# EAGLE design 6WLS-40W-OTHER (EAGLE 7.4.0)
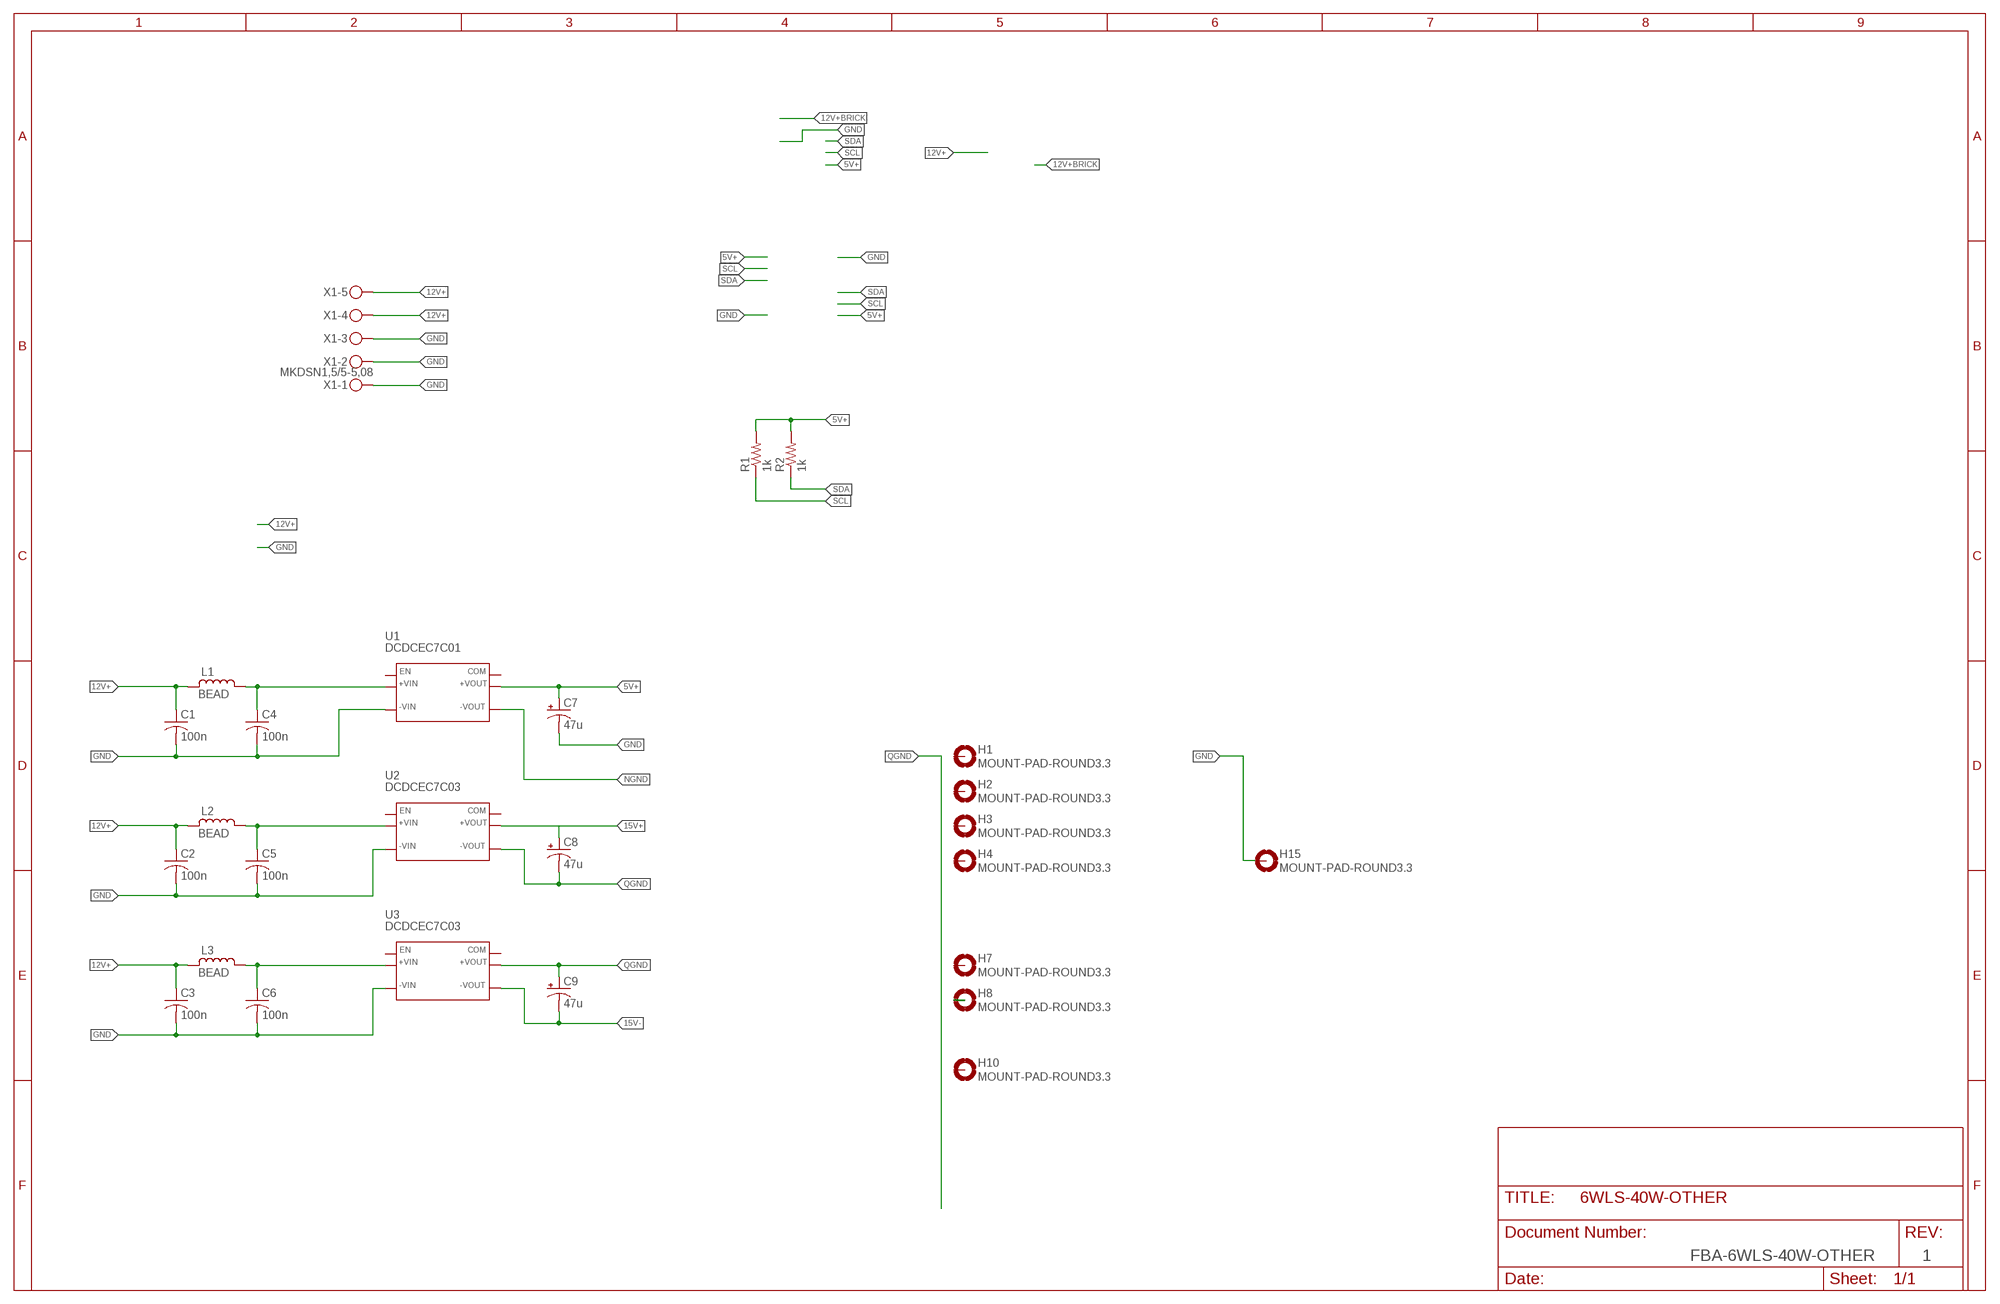
[diagram p0: schematic, sheet 1]

## Parts
C1  100n  C-US050-025X075  [C050-025X075]
C2  100n  C-US050-025X075  [C050-025X075]
C3  100n  C-US050-025X075  [C050-025X075]
C4  100n  C-US050-025X075  [C050-025X075]
C5  100n  C-US050-025X075  [C050-025X075]
C6  100n  C-US050-025X075  [C050-025X075]
C7  47u  CPOL-USE5-6  [E5-6]
C8  47u  CPOL-USE5-6  [E5-6]
C9  47u  CPOL-USE5-6  [E5-6]
H1  MOUNT-PAD-ROUND3.3  [3,3-PAD]
H2  MOUNT-PAD-ROUND3.3  [3,3-PAD]
H3  MOUNT-PAD-ROUND3.3  [3,3-PAD]
H4  MOUNT-PAD-ROUND3.3  [3,3-PAD]
H7  MOUNT-PAD-ROUND3.3  [3,3-PAD]
H8  MOUNT-PAD-ROUND3.3  [3,3-PAD]
H10  MOUNT-PAD-ROUND3.3  [3,3-PAD]
H15  MOUNT-PAD-ROUND3.3  [3,3-PAD]
L1  BEAD  L  [BEAD]
L2  BEAD  L  [BEAD]
L3  BEAD  L  [BEAD]
R1  1k  R-US_0207/7  [0207/7]
R2  1k  R-US_0207/7  [0207/7]
U1  DCDCEC7C01  [EC7C]
U2  DCDCEC7C03  [EC7C]
U3  DCDCEC7C03  [EC7C]
X1  MKDSN1,5/5-5,08  [MKDSN1,5/5-5,08]

## Nets
5V+: C7.+ R1.2 R2.2 U1.S+(+VOUT) U1.VO+(+VOUT)
12V+: C1.1 C2.1 C3.1 L1.1 L2.1 L3.1 X1.4 X1.5
15V+: C8.+ U2.S+(+VOUT) U2.VO+(+VOUT)
15V-: C9.- U3.S-(-VOUT) U3.VO-(-VOUT)
GND: C1.2 C2.2 C3.2 C4.2 C5.2 C6.2 C7.- H15.B3,3(MOUNT) U1.VIN-(-VIN) U2.VIN-(-VIN) U3.VIN-(-VIN) X1.1 X1.2 X1.3
N$1: C5.1 L2.2 U2.VIN+(+VIN)
N$2: C6.1 L3.2 U3.VIN+(+VIN)
N$3: C4.1 L1.2 U1.VIN+(+VIN)
N$5: H8.B3,3(MOUNT)
NGND: U1.S-(-VOUT) U1.VO-(-VOUT)
QGND: C8.- C9.+ U2.S-(-VOUT) U2.VO-(-VOUT) U3.S+(+VOUT) U3.VO+(+VOUT)
SCL: R1.1
SDA: R2.1
Unconnected: H1.B3,3(MOUNT) H2.B3,3(MOUNT) H3.B3,3(MOUNT) H4.B3,3(MOUNT) H7.B3,3(MOUNT) H10.B3,3(MOUNT) U1.ONOFF(EN) U2.ONOFF(EN) U3.ONOFF(EN)

## Notes on the sheet
- FBA-6WLS-40W-OTHER | 1

## Power pins joined to a net without a drawn wire
COM: U1.NC(COM) U2.NC(COM) U3.NC(COM)

## Library data of the parts
C1-C6 = resistor:C-US: CAPACITOR, American symbol
C7-C9 = resistor:CPOL-US: POLARIZED CAPACITOR, American symbol
H1-H4 H7 H8 H10 H15 = holes:MOUNT-PAD-ROUND: MOUNTING PAD, round
L1-L3 = studio_h:L: Inductor; MF: LAIRD; MPN: 28L0138-80R-10; Z_DIGIKEY: 240-2513-2-ND; Z_SMT: N
R1 R2 = resistor:R-US_: RESISTOR, American symbol
U1-U3 = studio_h:DCDC: DCDC Converter
X1 = con-phoenix-508:MKDSN1,5/5-5,08: MKDSN 1,5/ 5-5,08 Printklemme Nennstrom: 13,5 A Nennspannung: 250 V Rastermaß: 5,08 mm Polzahl: 5 Anschlussart: Schraubanschluss Montage: Löten Anschlussrichtung Leiter/Platine: 0 ° Artikelnummer: 1729157 Source: http://eshop.phoenixcontact.com .. 1729157.pdf

## Net classes
0 Signal: width 0.254 mm, clearance 0.205 mm
1 Power: width 0.508 mm, clearance 0.205 mm to class 0, clearance 0.205 mm
2 GND: width 0.889 mm

## Board
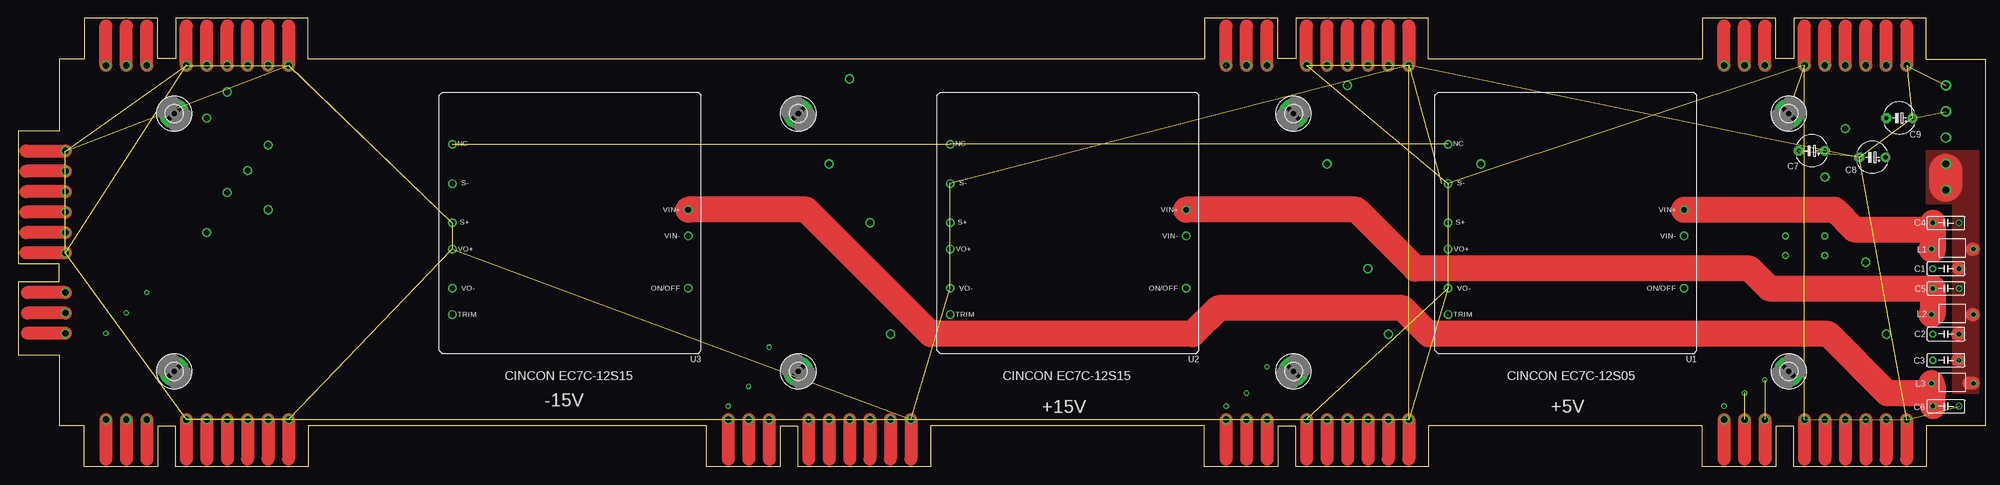
[diagram p1: board, top side]
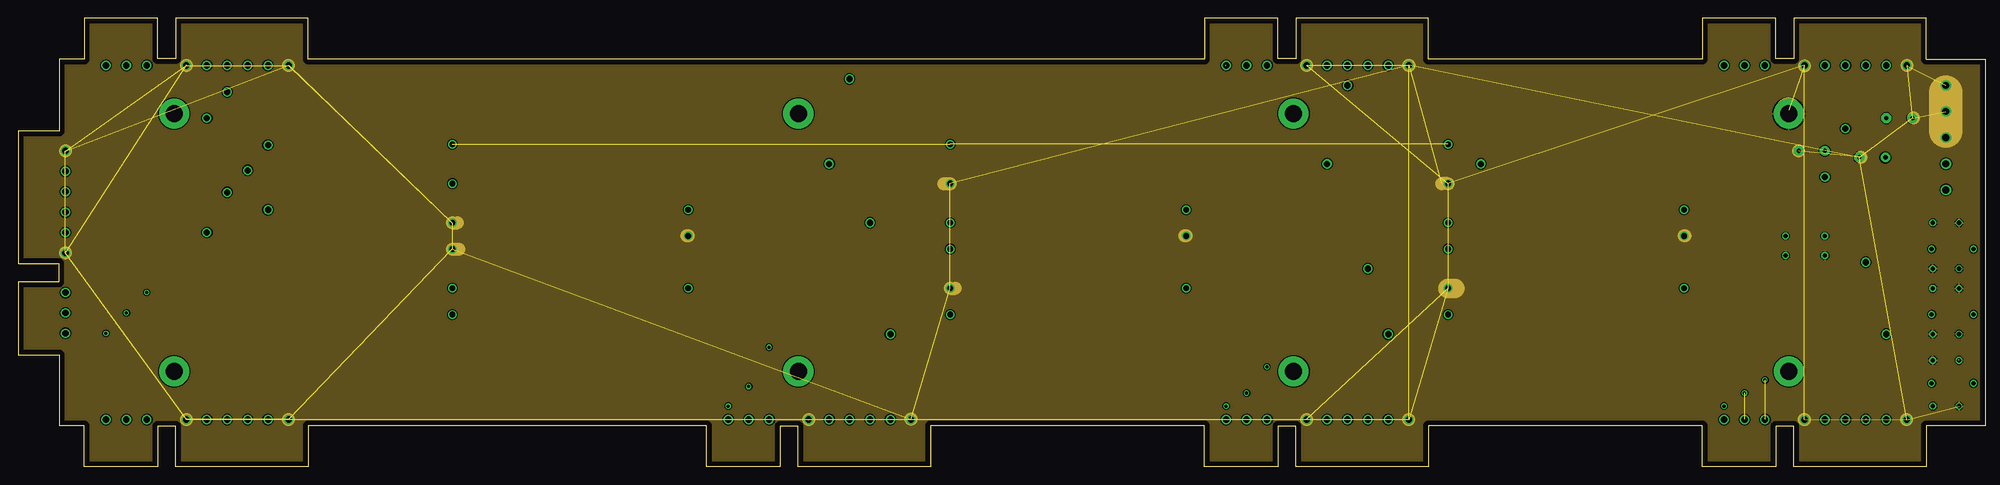
[diagram p2: board, inner layer Route2]
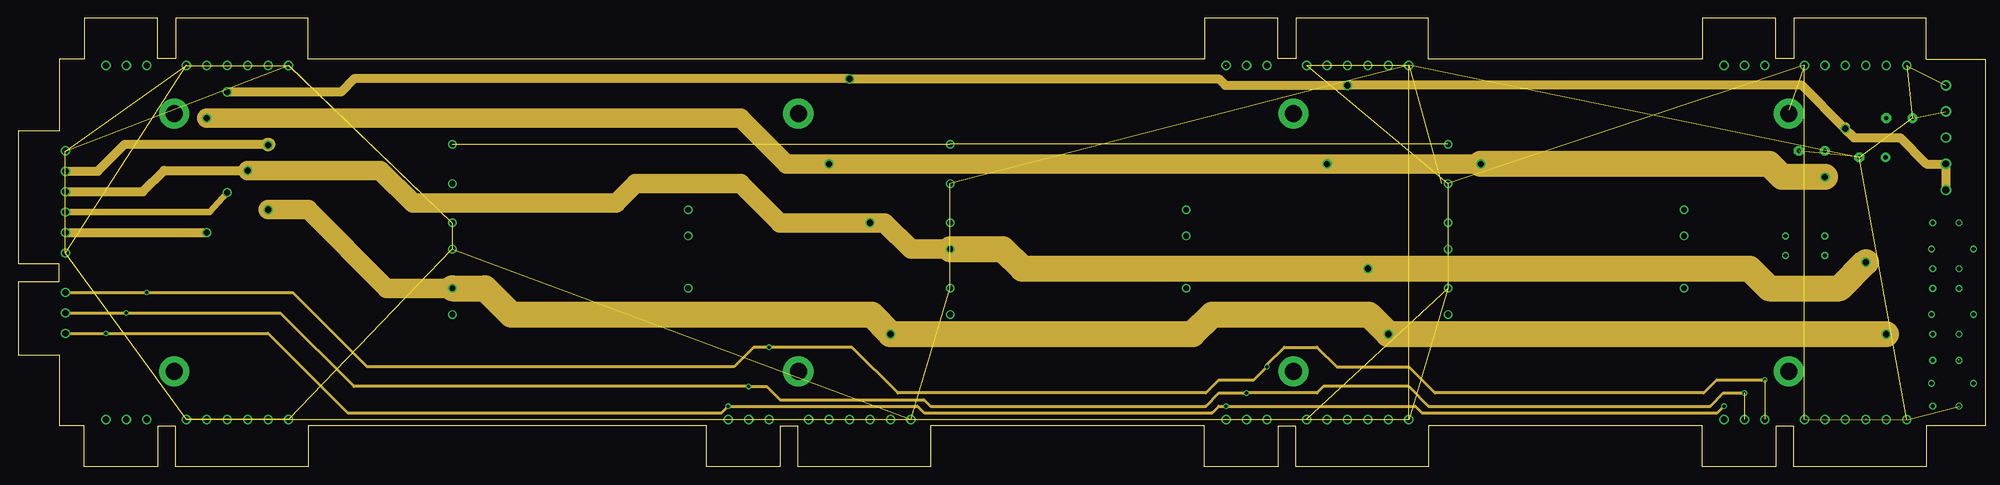
[diagram p3: board, inner layer Route15]
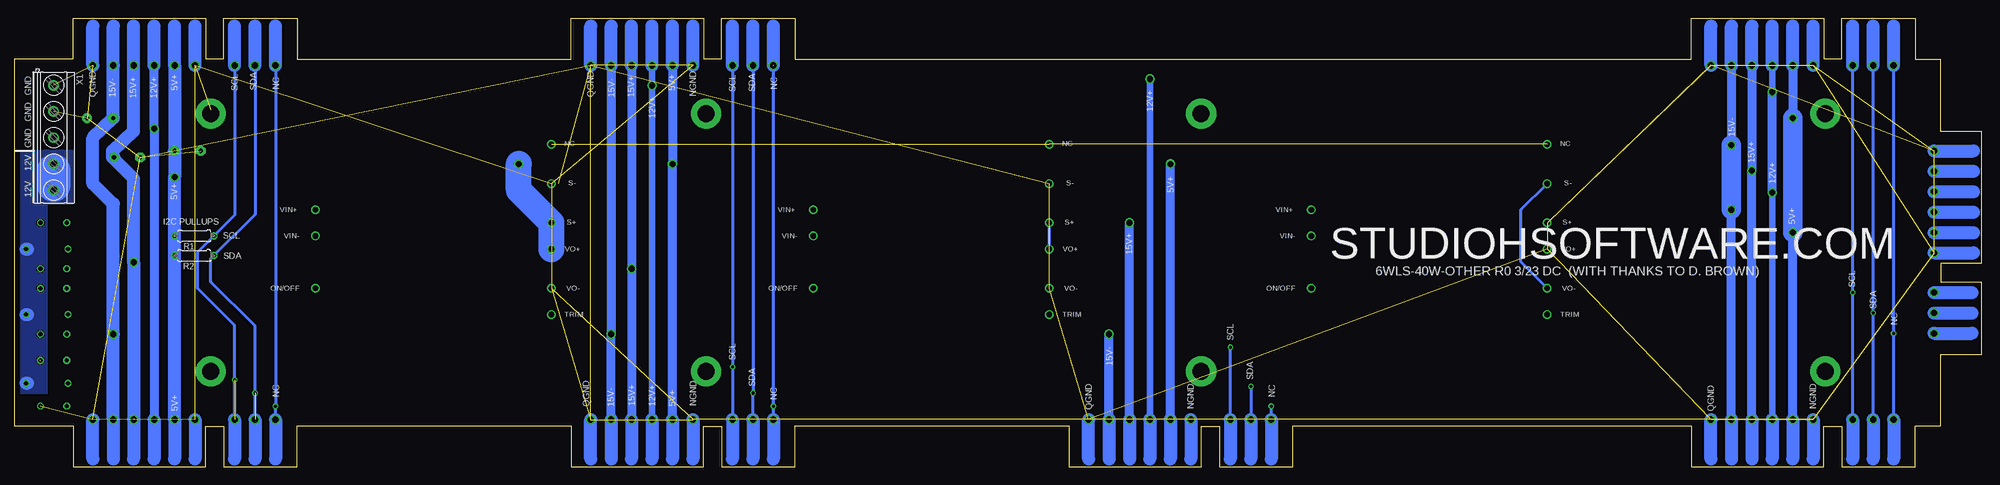
[diagram p4: board, bottom side, seen from below]

Size 381.32 x 87 mm. Coordinates in mm from the lower left corner, seen from the top.
Outline: 56.2,7.94 56.2,0 30.54,0 30.54,7.87 26.99,7.87 26.99,0 12.76,0 12.76,7.94 7.94,7.94 7.94,21.65 0,21.65 0,35.88 7.87,35.88 7.87,39.43 0,39.43 0,65.09 7.94,65.09 7.94,79.06 12.76,79.06 12.76,87 26.99,87 26.99,79.12 30.54,79.12 30.54,87 56.2,87 56.2,79.06 229.93,79.06 229.93,87 244.16,87 244.16,79.12 247.71,79.12 247.71,87 273.37,87 273.37,79.06 326.45,79.06 326.45,87 340.68,87 340.68,79.12 344.23,79.12 344.23,87 369.89,87 369.89,79.06 381.32,79.06 381.32,7.94 369.89,7.94 369.89,0 344.23,0 344.23,7.87 340.68,7.87 340.68,0 326.45,0 326.45,7.94 273.37,7.94 273.37,0 247.71,0 247.71,7.87 244.16,7.87 244.16,0 229.93,0 229.93,7.94 176.85,7.94 176.85,0 151.19,0 151.19,7.87 147.64,7.87 147.64,0 133.41,0 133.41,7.94 56.2,7.94
Copper layers (1*2*15*16): Top 0.035mm / dielectric 0.2mm / Route2 0.035mm / dielectric 1mm / Route15 0.035mm / dielectric 0.2mm / Bottom 0.035mm
Design rules "default *": minimum track width 10mil, minimum drill 20mil, track to track 8mil, track to pad 8mil, pad to pad 8mil, via to via 8mil, smd to smd 8mil, copper to edge 40mil, drill to drill 8mil, minimum pad ring 10mil, minimum via ring 8mil, stop-mask expansion 4mil, vias tented up to drill 0mil, thermal gap 10mil

### Footprints (pad centres in the part's own frame; a part is rotated, then mirrored left to right if it is on the bottom)
C050-025X075 = drill 0.813 octagon: 1 -2.54,0; 2 2.54,0
E5-6 = drill 0.813 pad 1.905: + -2.54,0 | drill 0.813 pad 1.905 octagon: - 2.54,0
3,3-PAD = drill 3.3 pad 5.842: B3,3 0,0
BEAD = drill 0.813: 1 -4.064,0; 2 4.064,0
0207/7 = drill 0.813 octagon: 1 -3.81,0; 2 3.81,0
EC7C = drill 1.1: NC 22.86,-16.51; ONOFF -22.86,11.43; S+ 22.86,-1.27; S- 22.86,-8.89; TRIM 22.86,16.51; VIN+ -22.86,-3.81; VIN- -22.86,1.27; VO+ 22.86,3.81; VO- 22.86,11.43
MKDSN1,5/5-5,08 = drill 1.3 pad 2: 1 -10.181,0.025; 2 -5.101,0.025; 3 -0.021,0.025; 4 5.059,0.025; 5 10.139,0.025

### Placement (x,y rotation side)
C1  373.7,38.42 180 top
C2  373.7,25.72 180 top
C3  373.7,20.64 180 top
C4  373.7,47.31 0 top
C5  373.7,34.61 0 top
C6  373.7,11.75 0 top
C7  347.69,61.28 180 top
C8  359.42,60.01 180 top
C9  364.66,67.63 180 top
H1  151.22,68.5 270 top
H2  151.22,18.5 270 top
H3  30.22,68.5 270 top
H4  30.22,18.5 270 top
H7  247.22,68.5 0 top
H8  247.22,18.5 0 top
H10  343.22,18.5 0 top
H15  343.22,68.5 0 top
L1  374.97,42.23 180 top
L2  374.97,29.53 180 top
L3  374.97,16.19 180 top
R1  346.42,44.77 180 bottom
R2  346.42,40.96 180 bottom
U1  300.04,46.04 180 top
U2  203.52,46.04 180 top
U3  107,46.04 180 top
X1  373.7,63.82 270 bottom

### Tracks (layer width: path | path; a pad name or v marks a point on that pad's centre or on a via)
5V+  (via drill 1.2)
  Top 2.54: v36.54,9.14 36.54,1.52 | v36.54,77.85 36.54,85.5 | v9.14,45.43 1.49,45.43 | v157.19,9.14 157.19,1.52 | v253.71,9.14 253.71,1.52 | v253.71,77.85 253.71,85.5 | v350.23,9.14 350.23,1.52 | v350.23,77.85 350.23,85.5
  Route15 1.778: v9.14,45.43 v36.54,45.43
  Route15 3.81: v36.54,67.63 140.02,67.63 148.91,58.74 v157.19,58.74 v253.71,58.74 v283.53,58.74
  Route15 5.08: v350.23,56.2 341.95,56.2 339.41,58.74 v283.53,58.74
  Bottom 1.27: 36.54,38.42 v36.54,45.43
  Bottom 1.778: v36.54,9.14 v36.54,45.43 | v36.54,77.85 v36.54,67.63 | v157.19,9.14 v157.19,58.74 | v253.71,77.85 v253.71,58.74 v253.71,9.14
  Bottom 2.54: v36.54,9.14 36.54,1.52 | v36.54,77.85 36.54,85.5 | v9.14,45.43 1.49,45.43 | v157.19,9.14 157.19,1.52 | v253.71,9.14 253.71,1.52 | v253.71,77.85 253.71,85.5 | 350.23,1.52 v350.23,9.14 R2.2 R1.2 v350.23,56.2 C7.+ v350.23,77.85 350.23,85.5
  Bottom 3.81: v36.54,67.63 v36.54,45.43
  Bottom 5.08: U1.VO+ U1.S+ 283.53,53.66 v283.53,58.74
12V+  (via drill 1.2)  (1 unrouted)
  Top 2.54: v40.5,9.14 40.5,1.52 | v40.5,77.85 40.5,85.5 | v9.14,49.39 1.49,49.39 | v257.67,9.14 257.67,1.52 | v257.67,77.85 257.67,85.5 | v354.19,9.14 354.19,1.52 | v354.19,77.85 354.19,85.5 | v161.15,9.14 161.15,1.52 | L3.1 378.14,16.19 | L2.1 378.78,29.53 | 375.91,20.69 376.19,20.69 | L1.1 378.78,42.23 | C2.1 375.96,25.72 376.24,25.69 376.19,25.77 C2.1 | C1.1 376.11,38.42 376.03,38.49 376.16,38.49 C1.1
  Top 6.452: 373.7,57.47 373.7,54.67
  Route15 1.27: v9.14,49.39 37.15,49.39 v40.5,53.2
  Route15 1.778: v40.5,72.71 62.55,72.71 65.09,75.25 v161.15,75.25 232.73,75.25 234,73.98 v257.67,73.98 345.76,73.98 354.01,65.72 | 354.01,65.72 355.92,63.82 364.81,63.82 369.89,58.74 373.65,58.74 X1.4 | v354.19,65.6 354.19,65.9 354.01,65.72 | 373.7,58.74 373.7,53.7 X1.5
  Bottom 1.27: v40.5,9.14 v40.5,53.2 | v40.5,77.85 v40.5,72.71 | v257.67,9.14 v257.67,73.98 v257.67,77.85 | v161.15,9.14 v161.15,75.25
  Bottom 1.778: v40.5,53.2 v40.5,72.71 | v354.19,9.14 v354.19,65.6 v354.19,77.85
  Bottom 2.54: v40.5,9.14 40.5,1.52 | v40.5,77.85 40.5,85.5 | v9.14,49.39 1.49,49.39 | v257.67,9.14 257.67,1.52 | v257.67,77.85 257.67,85.5 | v354.19,9.14 354.19,1.52 | v354.19,77.85 354.19,85.5 | v161.15,9.14 161.15,1.52 | L1.1 378.78,42.23 | L2.1 378.78,29.53 | L3.1 378.78,16.19
  Bottom 6.452: 373.7,57.47 373.7,54.67
  pour Top: 369.89,61.28 369.89,51.12 374.97,51.12 374.97,14.29 380.05,14.29 380.05,61.28
  pour Bottom: 369.89,61.28 380.05,61.28 380.05,14.29 374.97,14.29 374.97,51.12 369.89,51.12
15V+  (via drill 1.2)  (1 unrouted)
  Top 2.54: v44.46,9.14 44.46,1.52 | v44.46,77.85 44.46,85.5 | v9.14,53.35 1.49,53.35 | v165.11,9.14 165.11,1.52 | v261.63,9.14 261.63,1.52 | v261.63,77.85 261.63,85.5 | v358.15,9.14 358.15,1.52 | v358.15,77.85 358.15,85.5
  Route15 1.778: v9.14,53.35 24.14,53.35 28.26,57.47 v44.46,57.47
  Route15 3.81: 181.93,42.23 173.04,42.23 167.96,47.31 v165.11,47.31 147.64,47.31 140.02,54.93 119.7,54.93 115.89,51.12 76.52,51.12 70.17,57.47 v44.46,57.47
  Route15 5.08: v358.15,39.69 353.07,34.61 339.41,34.61 335.6,38.42 v261.63,38.42 194.63,38.42 190.82,42.23 181.93,42.23 U2.VO+
  Bottom 0.61: U2.VO+ U2.S+
  Bottom 1.778: v44.46,9.14 v44.46,57.47 v44.46,77.85 | v165.11,9.14 v165.11,47.31 | v261.63,9.14 v261.63,38.42 v261.63,77.85
  Bottom 2.54: v44.46,9.14 44.46,1.52 | v44.46,77.85 44.46,85.5 | v9.14,53.35 1.49,53.35 | v165.11,9.14 165.11,1.52 | v261.63,9.14 261.63,1.52 | v261.63,77.85 261.63,85.5 | v358.15,9.14 358.15,1.52 | 358.15,85.5 v358.15,77.85 358.15,65.09 362.27,61.28 362.27,60.01 | 362.27,60.01 358.15,55.89 v358.15,39.69 358.15,9.27 | C8.+ 362.27,60.01
15V-  (via drill 1.2)
  Top 2.54: v48.43,9.14 48.43,1.52 | v48.43,77.85 48.43,85.5 | v9.14,57.32 1.49,57.32 | v169.08,9.14 169.08,1.52 | v265.6,9.14 265.6,1.52 | v265.6,77.85 265.6,85.5 | v362.12,9.14 362.12,1.52 | v362.12,77.85 362.12,85.5
  Route15 0.61: 169.23,25.72 v169.08,25.72
  Route15 1.778: v9.14,57.32 15.41,57.32 20.64,62.55 48.27,62.55
  Route15 2.54: 48.58,62.55 v48.43,62.4 48.27,62.55
  Route15 3.81: v48.43,49.85 56.2,49.85 71.44,34.61 U3.VO-
  Route15 5.08: v169.08,25.72 165.42,29.53 95.57,29.53 90.49,34.61 U3.VO- | 169.23,25.72 227.65,25.72 231.46,29.53 261.79,29.53 v265.6,25.72 v362.12,25.72
  Bottom 0.61: U3.VO- 89.22,39.69 89.22,49.85 U3.S-
  Bottom 1.778: v48.43,9.14 v48.43,49.85 | v48.43,77.85 v48.43,62.4 | v169.08,9.14 v169.08,25.72 | v265.6,9.14 v265.6,25.72 v265.6,77.85
  Bottom 2.54: v48.43,9.14 48.43,1.52 | v48.43,77.85 48.43,85.5 | v9.14,57.32 1.49,57.32 | v169.08,9.14 169.08,1.52 | v265.6,9.14 265.6,1.52 | v265.6,77.85 265.6,85.5 | 362.12,1.52 v362.12,9.14 v362.12,25.72 362.12,50.97 366.08,54.93 366.08,63.82 C9.- v362.12,77.85 362.12,85.5
  Bottom 3.81: v48.43,49.85 v48.43,62.4
COM  (2 unrouted)
GND  (20 unrouted)
  Top 5.08: H15.B3,3 343.22,68.9
  Route2 2.54: 277.18,54.93 275.91,54.93 | U2.VIN- 226.12,44.77 | 84.14,42.23 85.41,42.23 | 173.04,9.21 173.06,9.21 | 153.2,9.11 153.23,9.11 | 32.55,9.18 32.58,9.18 | 52.36,9.16 52.39,9.16 | 9.13,41.49 9.16,41.49 | 9.13,61.25 9.16,61.25 | 32.58,77.84 32.6,77.84 | 52.39,77.84 52.41,77.84 | 249.75,77.86 249.77,77.86 | 269.56,77.86 269.58,77.86 | 249.72,9.13 249.75,9.13 | 269.53,9.13 269.56,9.13 | 346.21,9.16 346.24,9.16 | 366.05,9.13 366.08,9.13 | 346.27,77.79 346.29,77.79 | 366.1,77.81 366.13,77.81 | 179.39,54.93 180.66,54.93 | U3.VIN- 129.6,44.77 | 84.14,47.31 85.15,47.31 | 180.66,34.61 181.67,34.61 | 323.15,44.77 U1.VIN- | 367.37,67.65 367.4,67.65 | 357.21,60.03 357.24,60.03 | 345.12,61.28 C7.-
  Route2 3.81: 278.45,34.61 277.18,34.61
  Route2 5.08: H15.B3,3 343.22,69.15
  Route2 6.452: 373.7,65.09 373.7,72.71
  Bottom 5.08: 343.22,68.9 H15.B3,3
  pour Route2: 7.94,79.06 7.94,65.09 0.32,65.09 0.32,21.91 7.94,21.91 7.94,7.94 13.02,7.94 13.02,0.32 56.2,0.32 56.2,7.94 133.67,7.94 133.67,0.32 176.85,0.32 176.85,7.94 230.19,7.94 230.19,0.32 273.37,0.32 273.37,7.94 326.71,7.94 326.71,0.32 369.89,0.32 369.89,7.94 381.32,7.94 381.32,79.06 369.89,79.06 369.89,86.68 326.71,86.68 326.71,79.06 273.37,79.06 273.37,86.68 230.19,86.68 230.19,79.06 56.2,79.06 56.2,86.68 13.02,86.68 13.02,79.06
N$1
  Top 5.08: L2.2 371.16,29.78 C5.1 339.41,34.61 335.6,38.42 270.83,38.42 259.4,49.85 U2.VIN+
N$2
  Top 5.08: C6.1 371.16,14.29 | 371.16,14.29 371.16,15.18 L3.2 | U3.VIN+ 152.72,49.85 176.85,25.72 227.65,25.72 232.73,30.8 268.29,30.8 273.37,25.72 350.84,25.72 362.27,14.29 371.16,14.29
N$3
  Top 5.08: C4.1 371.16,46.04 | 371.16,46.04 371.16,42.23 L1.2 | U1.VIN+ 352.11,49.85 355.92,46.04 371.16,46.04
NC  (via drill 0.6, 1.2)  (1 unrouted)
  Top 2.54: v16.98,9.14 16.98,1.52 | v16.98,77.85 16.98,85.5 | v9.14,25.87 1.75,25.87 | v137.63,9.14 137.63,1.52 | v234.15,9.14 234.15,1.52 | v234.15,77.85 234.15,85.5 | v330.67,9.14 330.67,1.52 | v330.67,77.85 330.67,85.5
  Route15 0.61: v9.14,25.87 v16.98,25.87 48.43,25.87 63.82,10.48 136.36,10.48 v137.63,11.75 174.31,11.75 175.58,10.48 231.46,10.48 232.73,11.75 v234.15,11.75 270.83,11.75 272.1,10.48 329.4,10.48 v330.67,11.75
  Bottom 0.61: v16.98,9.14 v16.98,25.87 v16.98,77.85 | v137.63,9.14 v137.63,11.75 | v234.15,9.14 v234.15,11.75 234.15,77.79 | v330.67,9.14 v330.67,11.75 v330.67,77.85
  Bottom 2.54: v16.98,9.14 16.98,1.52 | v16.98,77.85 16.98,85.5 | v9.14,25.87 1.75,25.87 | v137.63,9.14 137.63,1.52 | v234.15,9.14 234.15,1.52 | v234.15,77.85 234.15,85.5 | v330.67,9.14 330.67,1.52 | v330.67,77.85 330.67,85.5
NGND  (via drill 1.2)  (9 unrouted)
  Top 2.54: v32.58,9.14 32.58,1.52 | v32.58,77.85 32.58,85.5 | v9.14,41.47 1.49,41.47 | v153.23,9.14 153.23,1.52 | v346.27,9.14 346.27,1.52 | v346.27,77.85 346.27,85.5 | v249.75,9.14 249.75,1.52 | v249.75,77.85 249.75,85.5
  Bottom 2.54: v32.58,9.14 32.58,1.52 | v32.58,77.85 32.58,85.5 | v9.14,41.47 1.49,41.47 | v153.23,9.14 153.23,1.52 | v346.27,9.14 346.27,1.52 | v346.27,77.85 346.27,85.5 | v249.75,9.14 249.75,1.52 | v249.75,77.85 249.75,85.5
QGND  (via drill 1.2)  (13 unrouted)
  Top 2.54: v52.39,9.14 52.39,1.52 | 52.39,85.5 v52.39,77.85 | 1.49,61.28 v9.14,61.28 | v173.04,9.14 173.04,1.52 | v269.56,9.14 269.56,1.52 | 269.56,85.5 v269.56,77.85 | v366.08,9.14 366.08,1.52 | 366.08,85.5 v366.08,77.85
  Bottom 2.54: 52.39,1.52 v52.39,9.14 | v52.39,77.85 52.39,85.5 | v9.14,61.28 1.49,61.28 | 173.04,1.52 v173.04,9.14 | 269.56,1.52 v269.56,9.14 | v269.56,77.85 269.56,85.5 | 366.08,1.52 v366.08,9.14 | v366.08,77.85 366.08,85.5
SCL  (via drill 0.6, 1.2)  (1 unrouted)
  Top 2.54: v24.9,9.14 24.9,1.52 | v24.9,77.85 24.9,85.5 | v9.14,33.79 1.75,33.79 | v145.55,9.14 145.55,1.52 | v242.07,9.14 242.07,1.52 | v242.07,77.85 242.07,85.5 | v338.59,9.14 338.59,1.52 | v338.59,77.85 338.59,85.5
  Route15 0.61: v9.14,33.79 v24.9,33.79 53.2,33.79 67.63,19.37 138.75,19.37 142.56,23.18 v145.55,23.18 161.61,23.18 170.5,14.29 230.19,14.29 232.73,16.83 239.53,16.83 v242.07,19.37 242.07,19.82 245.43,23.18 251.78,23.18 255.59,19.37 269.56,19.37 274.64,14.29 326.71,14.29 329.25,16.83 v338.59,16.83
  Bottom 0.61: v338.59,9.14 338.59,27.44 345.76,34.61 345.76,41.62 R1.1 338.59,48.78 v338.59,77.85 | v24.9,9.14 v24.9,33.79 v24.9,77.85 | v242.07,9.14 v242.07,19.37 v242.07,77.85 | v145.55,9.14 v145.55,23.18
  Bottom 2.54: v24.9,9.14 24.9,1.52 | v24.9,77.85 24.9,85.5 | v9.14,33.79 1.75,33.79 | v145.55,9.14 145.55,1.52 | v242.07,9.14 242.07,1.52 | v242.07,77.85 242.07,85.5 | v338.59,9.14 338.59,1.52 | v338.59,77.85 338.59,85.5
SDA  (via drill 0.6, 1.2)  (1 unrouted)
  Top 2.54: v20.94,9.14 20.94,1.52 | v20.94,77.85 20.94,85.5 | v9.14,29.83 1.75,29.83 | v141.59,9.14 141.59,1.52 | v238.11,9.14 238.11,1.52 | v238.11,77.85 238.11,85.5 | v334.63,9.14 334.63,1.52 | v334.63,77.85 334.63,85.5
  Route15 0.61: v9.14,29.83 v20.94,29.83 50.81,29.83 65.09,15.56 v141.59,15.56 145.1,15.56 147.64,13.02 175.58,13.02 176.85,11.75 230.19,11.75 232.73,14.29 v238.11,14.29 251.78,14.29 253.05,15.56 269.56,15.56 273.37,11.75 327.98,11.75 330.52,14.29 v334.63,14.29
  Bottom 0.61: v141.59,15.56 v141.59,9.14 | v20.94,9.14 v20.94,29.83 v20.94,77.85 | v334.63,9.14 334.63,27.29 343.22,35.88 343.22,40.35 R2.1 334.63,48.93 v334.63,77.85 | v238.11,77.85 v238.11,14.29 v238.11,9.14
  Bottom 2.54: v20.94,9.14 20.94,1.52 | v20.94,77.85 20.94,85.5 | v9.14,29.83 1.75,29.83 | v141.59,9.14 141.59,1.52 | v238.11,9.14 238.11,1.52 | v238.11,77.85 238.11,85.5 | v334.63,9.14 334.63,1.52 | v334.63,77.85 334.63,85.5

### Text on the board
tNames: CINCON EC7C-12S15 | CINCON EC7C-12S15 | CINCON EC7C-12S05 | -15V | +5V | +15V
bNames: GND | NC | SDA | SCL | 5V+ | NC | SDA | SCL | 5V+ | NGND | 15V+ | 15V- | QGND | 12V+ | 15V+ | 15V- | QGND | GND | 12V+ | 12V+ | GND | 15V- | 12V | 15V+ | 12V+ | 12V | 5V+ | 5V+ | 5V+ | I2C PULLUPS | SCL | 15V+ | STUDIOHSOFTWARE.COM | SDA | 6WLS-40W-OTHER R0 3/23 DC (WITH THANKS TO D. BROWN) | SCL | SDA | NC | SCL | SCL | 15V- | SDA | SDA | NC | NC | NC | NGND | 5V+ | 12V+ | 15V+ | 15V- | QGND | NGND | QGND | NGND | QGND | 5V+